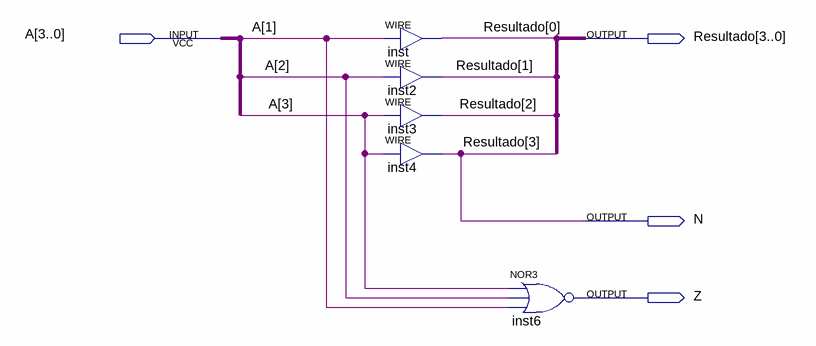
[diagram p0: schematic sheet]
// Quartus schematic ASR.bdf as structural Verilog: 5 symbols, 4 pins
module ASR (
  input  [3:0] A,
  output [3:0] Resultado,
  output N,
  output Z
);

  assign Resultado[0] = A[1];  // WIRE inst
  assign Resultado[1] = A[2];  // WIRE inst2
  assign Resultado[2] = A[3];  // WIRE inst3
  assign N = A[3];  // WIRE inst4
  nor inst6 (Z, A[3], A[2], A[1]);

  assign Resultado[3] = N;
endmodule
